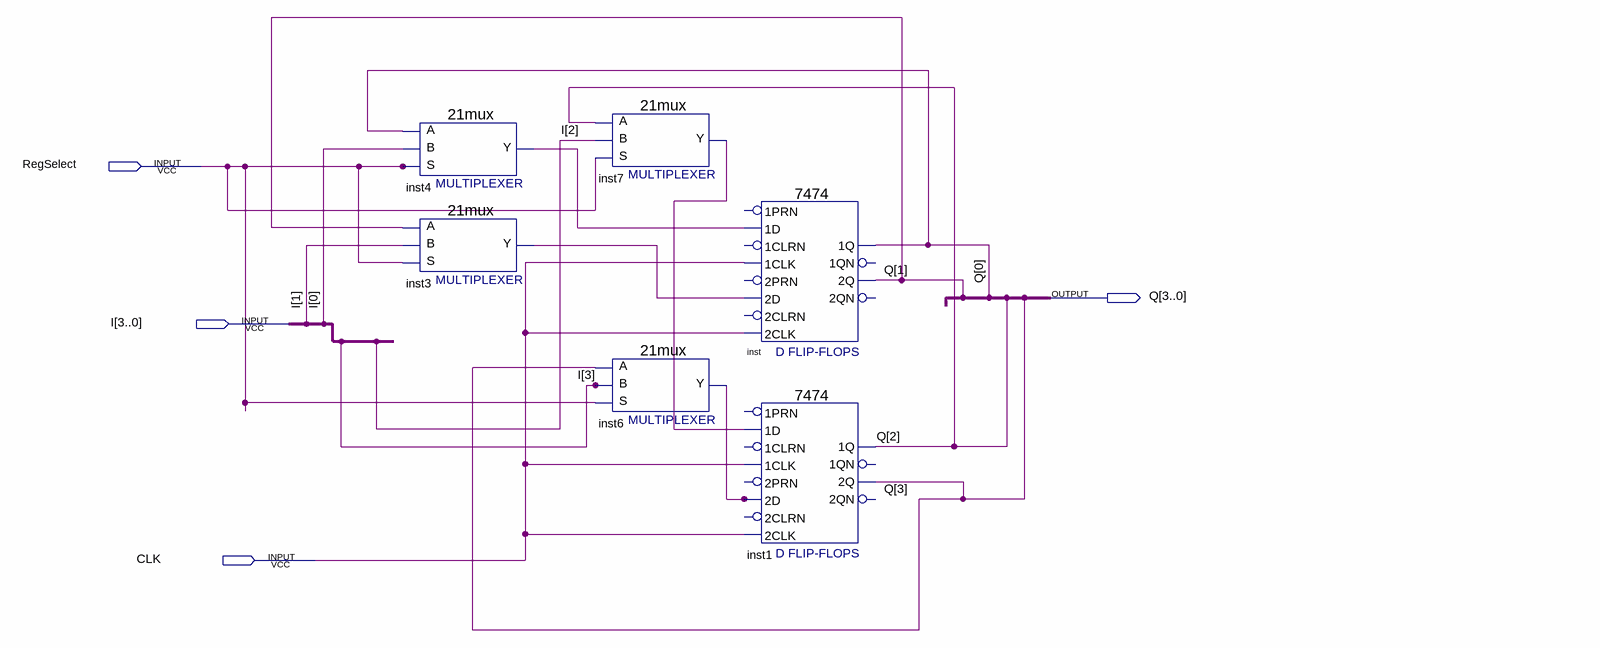
[diagram p0: schematic sheet]
// Quartus schematic Block1.bdf as structural Verilog: 6 symbols, 4 pins
module Block1 (
  input  RegSelect,
  input  [3:0] I,
  input  CLK,
  output [3:0] Q
);

  wire inst3_y, inst4_y, inst6_y, inst7_y;

  \21mux  inst4 (.S(RegSelect), .B(I[0]), .A(Q[0]), .Y(inst4_y));
  \21mux  inst3 (.S(RegSelect), .B(I[1]), .A(Q[1]), .Y(inst3_y));
  \21mux  inst7 (.S(RegSelect), .B(I[2]), .A(Q[2]), .Y(inst7_y));
  \21mux  inst6 (.S(RegSelect), .B(I[3]), .A(Q[3]), .Y(inst6_y));
  \7474  inst (
    .\2D (inst3_y), .\1CLK (CLK), .\1D (inst4_y), .\2CLK (CLK), .\2Q (Q[1]), .\1Q (Q[0]));  // open: 2PRN, 1PRN, 2CLRN, 1CLRN, 1QN, 2QN
  \7474  inst1 (
    .\2D (inst6_y), .\1CLK (CLK), .\1D (inst7_y), .\2CLK (CLK), .\2Q (Q[3]), .\1Q (Q[2]));  // open: 2PRN, 1PRN, 2CLRN, 1CLRN, 1QN, 2QN
endmodule
